# Altium schematic sheet pro.SchDoc: DEBUG406_AUTOCAR_2018
size A3; Author: WLYS; Revision: Rev0.9
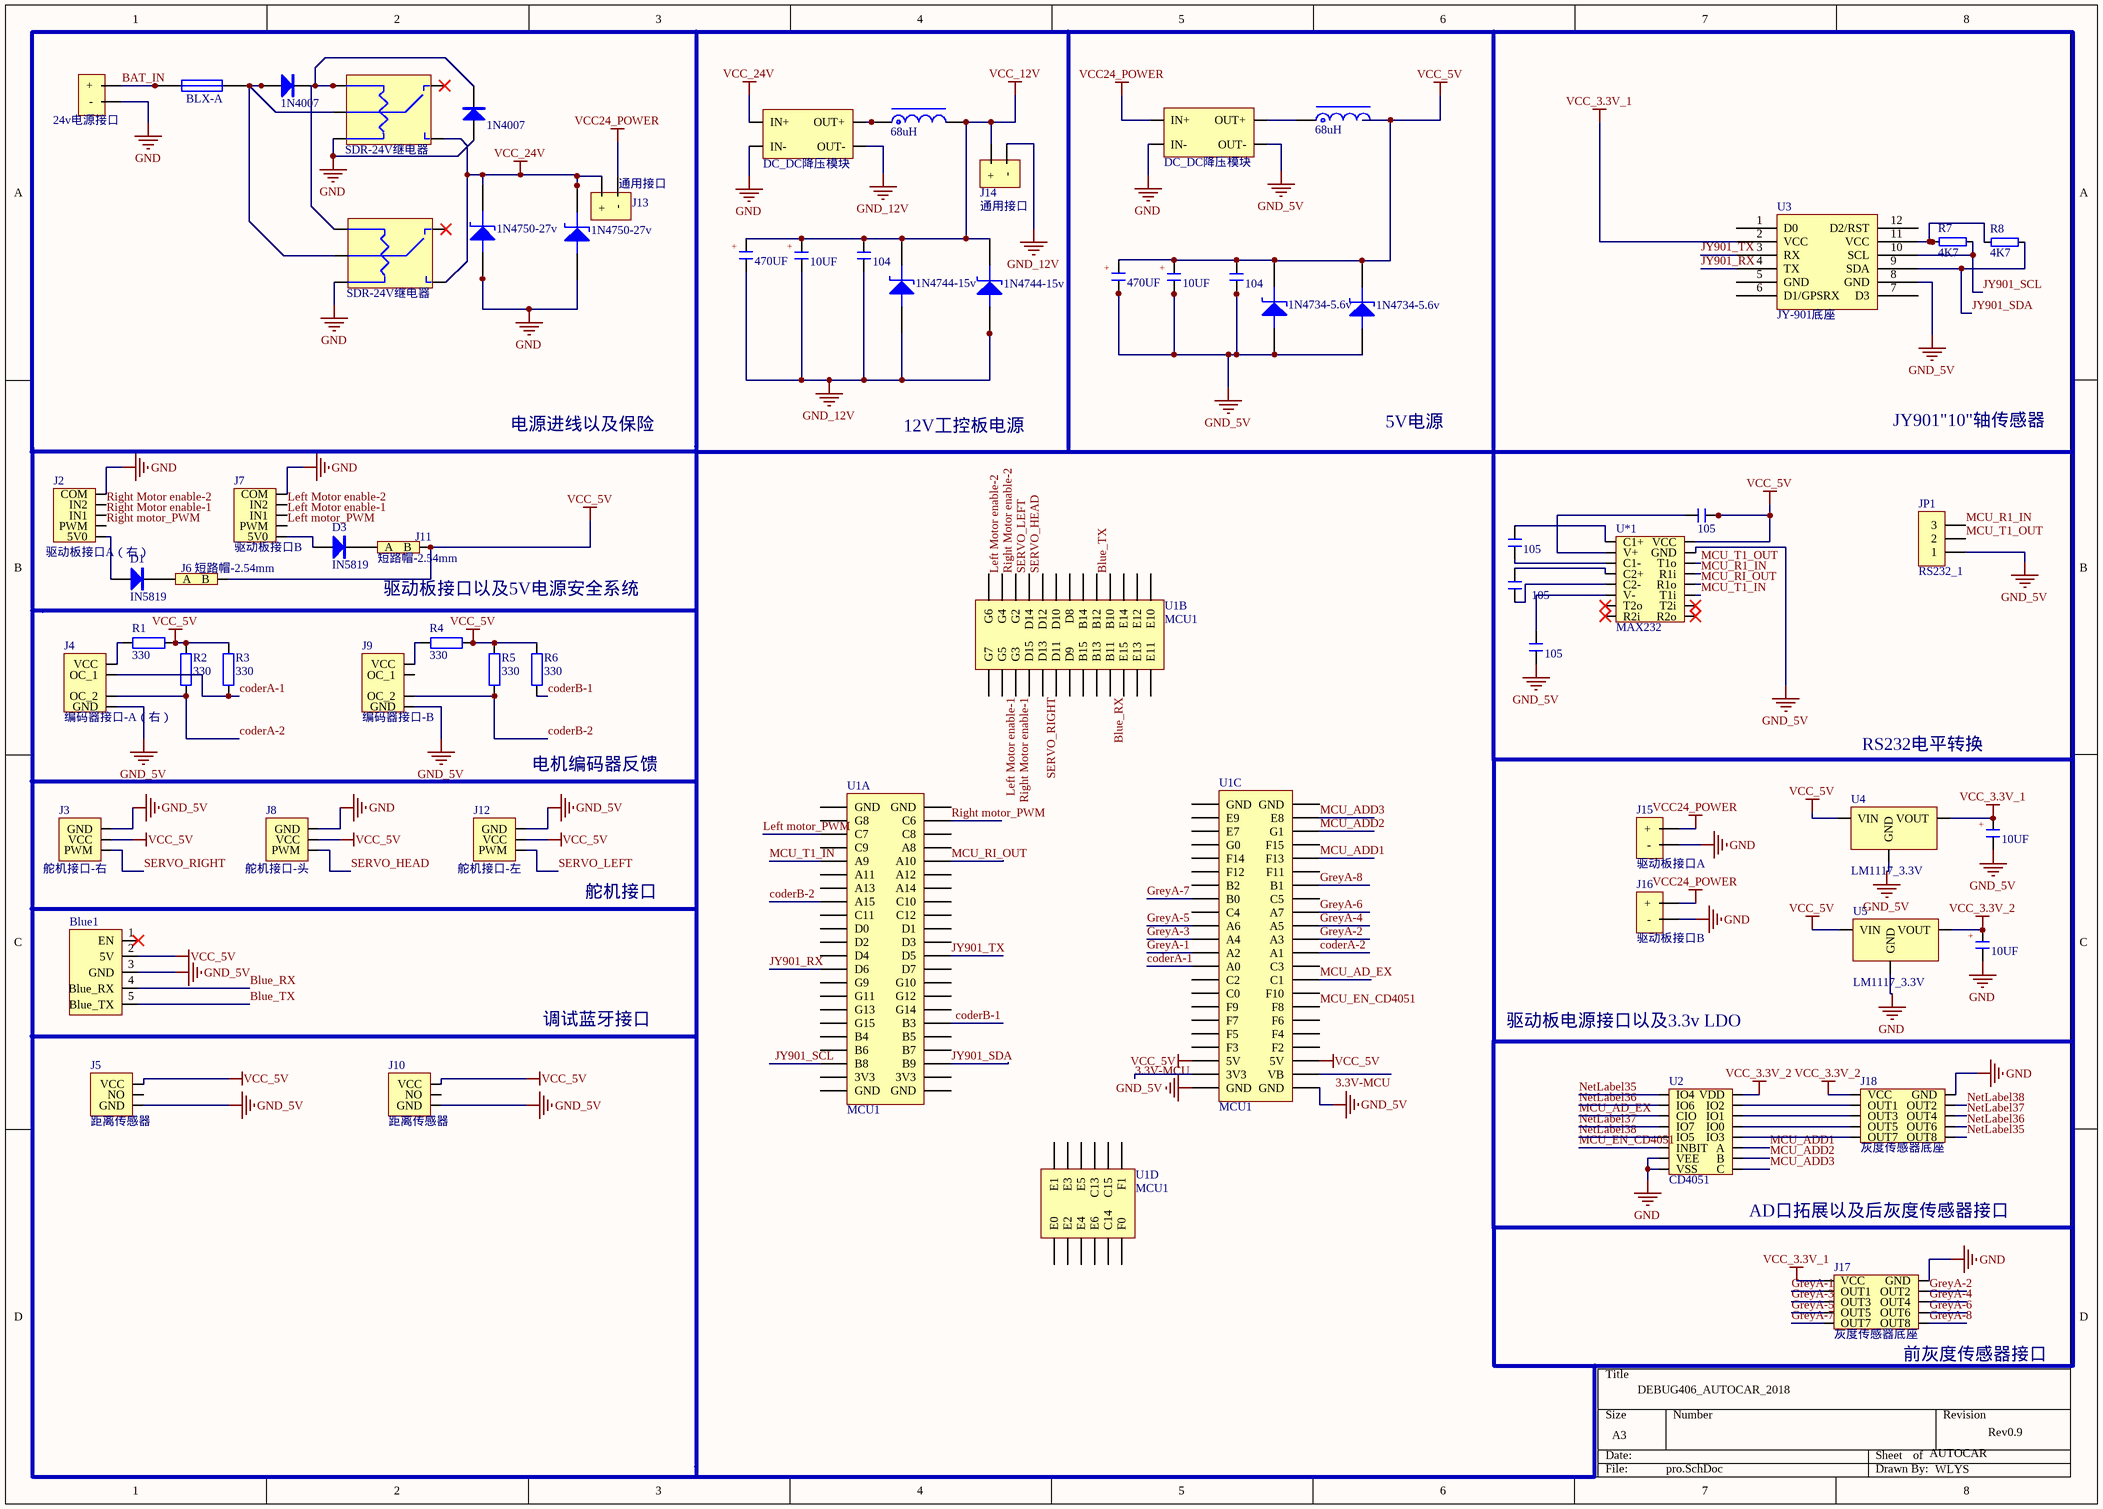
[diagram p0: pro.SchDoc]

## Parts
1  (no value)  [FU BLX-A]
Blue1  (no value)  [HDR2.54-M-LI-5P]
C1  470UF  [CAP10]
C2  10UF  [CAP6.3]
C3  104  [1206C]
C4  470UF  [CAP10]
C5  10UF  [CAP6.3]
C6  104  [1206C]
C7  105  [1206C]
C8  105  [1206C]
C9  105  [1206C]
C10  105  [1206C]
C11  10UF  [CAP6.3]
C12  10UF  [CAP6.3]
D1  IN5819  [DO-41]
D2  1N4007  [DO-41]
D3  IN5819  [DO-41]
D4  1N4007  [DO-41]
D5  1N4750-27v  [DO-41]
D6  1N4750-27v  [DO-41]
D7  1N4744-15v  [DO-41]
D8  1N4744-15v  [DO-41]
D9  1N4734-5.6v  [DO-41]
D10  1N4734-5.6v  [DO-41]
DC1  DC_DC降压模块  [DC_DC降压模块]
DC2  DC_DC降压模块  [DC_DC降压模块]
J1  (no value)  [autocar_battery]
J2  驱动板接口A（右）  [XH2.54-LI-5P]
J3  舵机接口-右  [XH2.54-LI-3P]
J4  编码器接口-A（右）  [XH2.54-LI-4P]
J5  距离传感器  [XH2.54-LI-3P]
J6  短路帽-2.54mm  [HDR2.54-LI-2P]
J7  驱动板接口B  [XH2.54-LI-5P]
J8  舵机接口-头  [XH2.54-LI-3P]
J9  编码器接口-B  [XH2.54-LI-4P]
J10  距离传感器  [XH2.54-LI-3P]
J11  短路帽-2.54mm  [HDR2.54-LI-2P]
J12  舵机接口-左  [XH2.54-LI-3P]
J13  通用接口  [通用接口]
J14  通用接口  [通用接口]
J15  驱动板接口A  [通用接口]
J16  驱动板接口B  [通用接口]
J17  灰度传感器底座  [DC-2.54-L-Z-10P]
J18  灰度传感器底座  [DC-2.54-L-Z-10P]
JP1  RS232_1  [XH2.54-LI-3P]
L1  68uH  [CDRH127]
L2  68uH  [CDRH127]
R1  330  [1206R]
R2  330  [1206R]
R3  330  [1206R]
R4  330  [1206R]
R5  330  [1206R]
R6  330  [1206R]
R7  4K7  [1206R]
R8  4K7  [1206R]
relay1  SDR-24V继电器  [SRD-C_B]
relay2  SDR-24V继电器  [SRD-C_B]
U1  MCU1  [核心板底座]  (parts A,B,C,D of 4)
U2  CD4051  [CD4051]
U3  JY-901底座  [JY901_过孔]
U4  LM1117_3.3V  [ASM1117_3.3V]
U5  LM1117_3.3V  [ASM1117_3.3V]
U*1  MAX232  [MAX232]

## Nets
GND: C11.2 D4.1(A) D5.1(A) D6.1(A) DC1.1(IN-) DC2.1(IN-) J1.1(-) J2.1(COM) J7.1(COM) J8.1(GND) J15.2(-) J16.2(-) J17.9(GND) J18.9(GND) relay1.2(coil) relay2.2(coil) U2.7(VEE) U2.8(VSS) U5.1(GND)
GND_5V: Blue1.3(GND) C4.2 C5.2 C6.2 C9.2 C12.2 D9.1(A) D10.1(A) DC2.3(OUT-) J3.1(GND) J4.4(GND) J5.3(GND) J9.4(GND) J10.3(GND) J12.1(GND) JP1.1 U1.113(GND) U1.114(GND) U3.8(GND) U4.1(GND) U*1.15(GND)
GND_12V: C1.2 C2.2 C3.2 D7.1(A) D8.1(A) DC1.3(OUT-) J14.2(-)
VCC24_POWER: DC2.0(IN+) J13.2(-) J15.1(+) J16.1(+)
VCC_3.3V_1: C12.1 J17.10(VCC) U3.2(VCC) U4.2(VOUT)
VCC_3.3V_2: C11.1 J18.10(VCC) U2.16(VDD) U5.2(VOUT)
VCC_5V: Blue1.2(5V) C4.1 C5.1 C6.1 C10.2 D9.2(K) D10.2(K) J3.2(VCC) J5.1(VCC) J6.2(B) J8.2(VCC) J10.1(VCC) J11.2(B) J12.2(VCC) L2.2 R1.2 R2.2 R3.2 R4.2 R5.2 R6.2 U1.109(5V) U1.110(5V) U4.3(VIN) U5.3(VIN) U*1.16(VCC)
VCC_12V: C1.1 C2.1 C3.1 D7.2(K) D8.2(K) J14.1(+) L1.2
VCC_24V: D5.2(K) D6.2(K) DC1.0(IN+) J13.1(+) relay1.5(close) relay2.5(close)
3.3V-MCU: U1.111(3V3) U1.112(VB)
BAT_IN: 1.1 J1.0(+)
Blue_RX: Blue1.4(Blue_RX) U1.63(B11)
Blue_TX: Blue1.5(Blue_TX) U1.64(B10)
coderA-1: J4.2(OC_1) R3.1 U1.95(A0)
coderA-2: J4.3(OC_2) R2.1 U1.94(A1)
coderB-1: R6.1 U1.11(B3)
coderB-2: J9.3(OC_2) R5.1 U1.30(A15)
GreyA-1: J17.8(OUT1) U1.93(A2)
GreyA-2: J17.7(OUT2) U1.92(A3)
GreyA-3: J17.6(OUT3) U1.91(A4)
GreyA-4: J17.5(OUT4) U1.90(A5)
GreyA-5: J17.4(OUT5) U1.89(A6)
GreyA-6: J17.3(OUT6) U1.88(A7)
GreyA-7: J17.2(OUT7) U1.85(B0)
GreyA-8: J17.1(OUT8) U1.84(B1)
JY901_RX: U1.20(D6) U3.4(TX)
JY901_SCL: R7.1 U1.6(B8) U3.10(SCL)
JY901_SDA: R8.1 U1.5(B9) U3.9(SDA)
JY901_TX: U1.21(D5) U3.3(RX)
Left Motor enable-1: J7.3(IN1) U1.47(G5)
Left Motor enable-2: J7.2(IN2) U1.48(G4)
Left motor_PWM: J7.4(PWM) U1.40(C7)
MCU_AD_EX: U1.98(C1) U2.3(CIO)
MCU_ADD1: U1.80(F13) U2.11(A)
MCU_ADD2: U1.76(G1) U2.10(B)
MCU_ADD3: U1.74(E8) U2.9(C)
MCU_EN_CD4051: U1.102(F8) U2.6(INBIT)
MCU_R1_IN: JP1.3 U*1.13(R1i)
MCU_RI_OUT: U1.35(A10) U*1.12(R1o)
MCU_T1_IN: U1.36(A9) U*1.11(T1i)
MCU_T1_OUT: JP1.2 U*1.14(T1o)
NetLabel35: J18.1(OUT8) U2.1(IO4)
NetLabel36: J18.3(OUT6) U2.2(IO6)
NetLabel37: J18.5(OUT4) U2.4(IO7)
NetLabel38: J18.7(OUT2) U2.5(IO5)
Right Motor enable-1: J2.3(IN1) U1.49(G3)
Right Motor enable-2: J2.2(IN2) U1.50(G2)
Right motor_PWM: J2.4(PWM) U1.41(C6)
SERVO_HEAD: J8.3(PWM) U1.54(D12)
SERVO_LEFT: J12.3(PWM) U1.52(D14)
SERVO_RIGHT: J3.3(PWM) U1.53(D13)
Net1_2: 1.2 D2.1(A) relay1.3(power) relay2.3(power)
NetC7_1: C7.1 U*1.1(C1+)
NetC7_2: C7.2 U*1.3(C1-)
NetC8_1: C8.1 U*1.4(C2+)
NetC8_2: C8.2 U*1.5(C2-)
NetC9_1: C9.1 U*1.6(V-)
NetC10_1: C10.1 U*1.2(V+)
NetD1_1: D1.1 J2.5(5V0)
NetD1_2: D1.2 J6.1(A)
NetD2_2: D2.2(K) D4.2(K) relay1.1(coil) relay2.1(coil)
NetD3_1: D3.1 J7.5(5V0)
NetD3_2: D3.2 J11.1(A)
NetDC1_2: DC1.2(OUT+) L1.1
NetDC2_2: DC2.2(OUT+) L2.1
NetJ4_1: J4.1(VCC) R1.1
NetJ9_1: J9.1(VCC) R4.1
NetJ18_2: J18.2(OUT7) U2.12(IO3)
NetJ18_4: J18.4(OUT5) U2.13(IO0)
NetJ18_6: J18.6(OUT3) U2.14(IO1)
NetJ18_8: J18.8(OUT1) U2.15(IO2)
NetR7_2: R7.2 R8.2 U3.11(VCC)

Not connected (* = marked no-connect by the designer): Blue1 1(EN)*; J5 2(NO); J9 2(OC_1); J10 2(NO); relay1 4(open)*; relay2 4(open)*; U1 1(GND) 2(GND) 3(3V3) 4(3V3) 7(B7) 8(B6) 9(B5) 10(B4) 12(G15) 13(G14) 14(G13) 15(G12) 16(G11) 17(G10) 18(G9) 19(D7) 22(D4) 23(D3) 24(D2) 25(D1) 26(D0) 27(C12) 28(C11) 29(C10) 31(A14) 32(A13) 33(A12) 34(A11) 37(A8) 38(C9) 39(C8) 42(G8) 43(GND) 44(GND) 45(G7) 46(G6) 51(D15) 55(D11) 56(D10) 57(D9) 58(D8) 59(B15) 60(B14) 61(B13) 62(B12) 65(E15) 66(E14) 67(E13) 68(E12) 69(E11) 70(E10) 71(GND) 72(GND) 73(E9) 75(E7) 77(G0) 78(F15) 79(F14) 81(F12) 82(F11) 83(B2) 86(C5) 87(C4) 96(C3) 97(C2) 99(C0) 100(F10) 101(F9) 103(F7) 104(F6) 105(F5) 106(F4) 107(F3) 108(F2) 115(F1) 116(F0) 117(C15) 118(C14) 119(C13) 120(E6) 121(E5) 122(E4) 123(E3) 124(E2) 125(E1) 126(E0); U3 1(D0) 5(GND) 6(D1/GPSRX) 7(D3) 12(D2/RST); U*1 7(T2o)* 8(R2i)* 9(R2o)* 10(T2i)*

## Notes on the sheet
- 电源进线以及保险
- 12V工控板电源
- 5V电源
- JY901"10"轴传感器
- 驱动板接口以及5V电源安全系统
- 电机编码器反馈
- RS232电平转换
- 舵机接口
- 调试蓝牙接口
- 驱动板电源接口以及3.3v LDO
- AD口拓展以及后灰度传感器接口
- (near J17) 前灰度传感器接口
- AUTOCAR
- (in symbol autocar_battery) 24v电源接口
- (in symbol CAP_SMT_3) +
- (in symbol CAP_SMT_5) +
- (in symbol 保险座) BLX-A

## Library data of the parts
1 = 保险座
Blue1 = BlueTooth_net
C1 C4 = CAP_SMT_5: SMT 10mm
C2 C5 C11 C12 = CAP_SMT_3: SMT 6.3mm
C3 C6-C10 = CC_SMT_4: SMT1206
D1 D3 = IN5819: 1A-40V肖特基
D2 D4 = 1N4007-DIP: Regulator
D5-D10 = 稳压二极管
DC1 DC2 = 5A_DC_DC降压模块
J1 = autocar_battery: 智能车24v电池连接端口
J2 J7 = 驱动板接口
J3 J8 J12 = 舵机接口
J4 J9 = 编码器接口
J15 J16 = 通用接口
JP1 = XH2.54_3Pins-DIP: White Small
L1 L2 = PowerShielded-L-SMT: PowerShieldedInductorSet
R1-R6 = 电阻-1206: 1206
R7 R8 = SMT1206: SMT_1206
U1 = 核心板插座
U3 = JY-901底座: 高精度9轴传感器
U4 U5 = ASM1117_3.3V